# Altium project uStepperS3DShield.PrjPcb
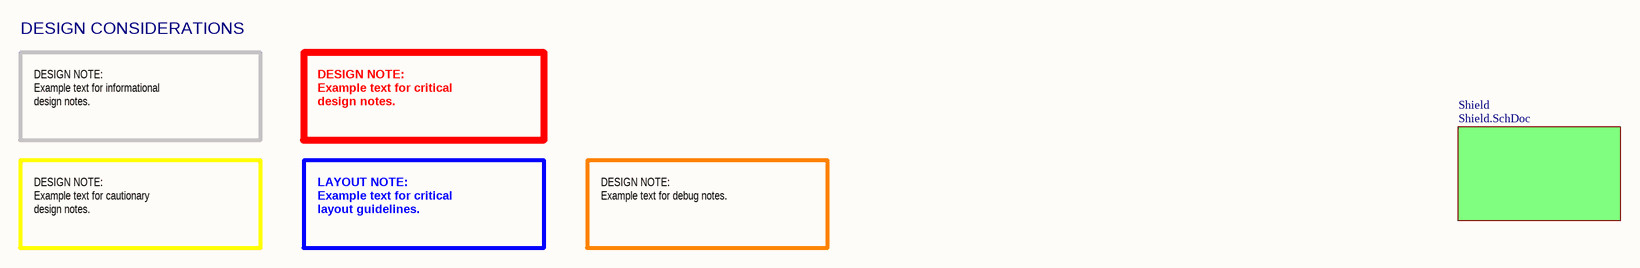
[diagram p0: CoverPage.SchDoc]
GlobalCompanyName: ON Development IVS; GlobalDrawnBy: Mogens G Nicolaisen; GlobalProjectName: uStepper S 3D Shield; GlobalProjectRevision: 1.0
2 sheets, 3 parts. Net scope: global (net labels, ports and power ports of the same name join across sheets).
Board file: Shield.PcbDoc
Sheets:
  CoverPage.SchDoc
    Shield = Shield.SchDoc

## Sheet CoverPage.SchDoc: =GlobalProjectName
size A3; DocumentNumber: 1; SheetNumber: 1; SheetTotal: 2

### Sub-sheets
Shield = Shield.SchDoc: no entries

### Notes on the sheet
- DESIGN CONSIDERATIONS
- DESIGN NOTE:
  Example text for informational
  design notes.
- DESIGN NOTE:
  Example text for critical
  design notes.
- DESIGN NOTE:
  Example text for cautionary
  design notes.
- LAYOUT NOTE:
  Example text for critical
  layout guidelines.
- DESIGN NOTE:
  Example text for debug notes.
- ON Development IVS
- Title:
- Size:
- A3
- Drawn By:
- Date:
- Sheet
- of
- Revision:

## Sheet Shield.SchDoc: =GlobalProjectName
size A3; SheetNumber: 2; SheetTotal: 2
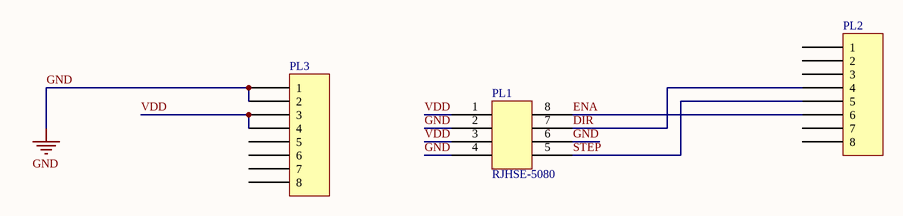
[diagram p1: Shield.SchDoc]

### Parts
PL1  RJHSE-5080  [AMPHENOL RJHSE-5080]
PL2  8-pin Male Header 2.54mm  [8-pin 2.54mm header]  (value not drawn)
PL3  8-pin Male Header 2.54mm  [8-pin 2.54mm header]  (value not drawn)

### Nets
GND: PL1.2 PL1.4 PL1.6 PL3.1 PL3.2
DIR: PL1.7 PL2.4
ENA: PL1.8 PL2.6
STEP: PL1.5 PL2.5
VDD: PL1.1 PL1.3 PL3.3 PL3.4

Not connected (* = marked no-connect by the designer): PL2 1 2 3 7 8; PL3 5 6 7 8

### Notes on the sheet
- ON Development IVS
- Title:
- Size:
- A3
- Drawn By:
- Date:
- Sheet
- of
- Revision:

### Library data of the parts
PL1 = CMP-003-0022-0.1: CONN MOD JACK 8P8C R/A UNSHLD; Shielding: Unshielded; Gender: Female; Current Rating: 1.5A; Voltage Rating: 125V; Contact Resistance: 20mR; Connector Type: Jack, RJ45; Number of Ports: 1; Direction: Up; Number of Contacts: 8; Pitch: 2.03mm; Mount: Panel, Through Hole; Contact Plating: Gold; Contact Material: Bronze; Colour: Black; Housing Material: Thermoplastic; Min Operating Temperature: -55°C; Max Operating Temperature: 85°C; Package Quantity: 36; Number of Rows: 1; Packaging: Tray; Max Current Rating: 1.5A; Termination: Solder; Number of Positions Loaded: 8; Max Voltage Rating (AC): 125V; Number of Positions: 8; Orientation: Right Angle; Voltage Rating (DC): 125V; Length: 15.75mm; Depth: 14.99mm; Radiation Hardening: No; REACH SVHC: Unknown; Lead Free: Lead Free; Flammability Rating: UL94 V-0
PL2 PL3 = CMP-003-0009-0.3